# EAGLE design tiny_13 (EAGLE 4.16)
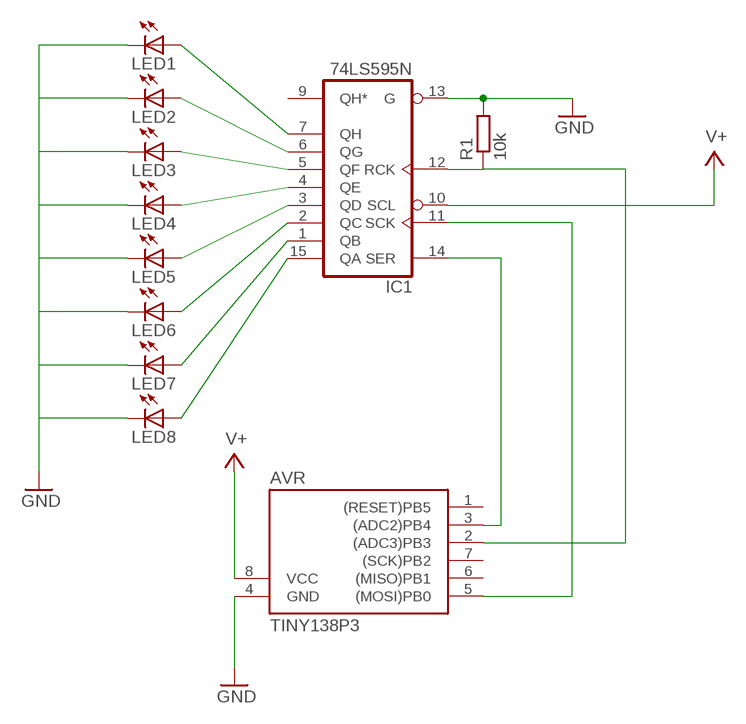
[diagram p0: schematic, sheet 1]

## Parts
AVR  TINY138P3  [DIL08]
IC1  74LS595N  [DIL16]
LED1  LED5MM  [LED5MM]
LED2  LED5MM  [LED5MM]
LED3  LED5MM  [LED5MM]
LED4  LED5MM  [LED5MM]
LED5  LED5MM  [LED5MM]
LED6  LED5MM  [LED5MM]
LED7  LED5MM  [LED5MM]
LED8  LED5MM  [LED5MM]
R1  10k  R-EU_0414/5V  [0414V]

## Nets
GND: AVR.4(GND) IC1.13(G) LED1.K(C) LED2.K(C) LED3.K(C) LED4.K(C) LED5.K(C) LED6.K(C) LED7.K(C) LED8.K(C) R1.2
N$1: AVR.2((ADC3)PB3) IC1.12(RCK) R1.1
N$2: IC1.7(QH) LED1.A
N$3: IC1.6(QG) LED2.A
N$4: IC1.5(QF) LED3.A
N$5: IC1.4(QE) LED4.A
N$6: IC1.3(QD) LED5.A
N$7: IC1.2(QC) LED6.A
N$8: IC1.1(QB) LED7.A
N$9: AVR.5((MOSI)PB0) IC1.11(SCK)
N$11: AVR.3((ADC2)PB4) IC1.14(SER)
N$12: IC1.15(QA) LED8.A
V+: AVR.8(VCC) IC1.10(SCL)
Unconnected: AVR.1((RESET)PB5) AVR.6((MISO)PB1) AVR.7((SCK)PB2) IC1.9(QH*)

## Power pins joined to a net without a drawn wire
GND: IC1.8(GND)
VCC: IC1.16(VCC)

## Library data of the parts
AVR = avr-3:TINY13*
IC1 = 74xx-us:74*595: 8-bit SHIFT REGISTER, output latch
LED1-LED8 = led:LED: LED OSRAM: - CHIPLED LG R971, LG N971, LY N971, LG Q971, LY Q971, LO R971, LY R971 LH N974, LH R974 LS Q976, LO Q976, LY Q976 LO Q996 - Hyper CHIPLED LW Q18S LB Q993, LB Q99A, LB R99A - SideLED LS A670, LO A670, LY A670, LG A670, LP A670 LB A673, LV A673, LT A673, LW A673 LH A674 LY A675 LS A676, LA A676, LO A676, LY A676, LW A676 LS A679, LY A679, LG A679 - Hyper Micro SIDELED® LS Y876, LA Y876, LO Y876, LY Y876 LT Y87S - SmartLED LW L88C, LW L88S LB L89C, LB L89S, LG L890 LS L89K, LO L89K, LY L89K LS L896, LA L896, LO L896, LY L896 - TOPLED LS T670, LO T670, LY T670, LG T670, LP T670 LSG T670, LSP T670, LSY T670, LOP T670, LYG T670 LG T671, LOG T671, LSG T671 LB T673, LV T673, LT T673, LW T673 LH T674 LS T676, LA T676, LO T676, LY T676, LB T676, LH T676, LSB T676, LW T676 LB T67C, LV T67C, LT T67C, LS T67K, LO T67K, LY T67K, LW E67C LS E67B, LA E67B, LO E67B, LY E67B, LB E67C, LV E67C, LT E67C LW T67C LS T679, LY T679, LG T679 LS T770, LO T770, LY T770, LG T770, LP T770 LB T773, LV T773, LT T773, LW T773 LH T774 LS E675, LA E675, LY E675, LS T675 LS T776, LA T776, LO T776, LY T776, LB T776 LHGB T686 LT T68C, LB T68C - Hyper Mini TOPLED® LB M676 - Mini TOPLED Santana® LG M470 LS M47K, LO M47K, LY M47K Source: http://www.osram.convergy.de - LUMILED® LXK2-PW12-R00, LXK2-PW12-S00, LXK2-PW14-U00, LXK2-PW14-V00 LXK2-PM12-R00, LXK2-PM12-S00, LXK2-PM14-U00 LXK2-PE12-Q00, LXK2-PE12-R00, LXK2-PE12-S00, LXK2-PE14-T00, LXK2-PE14-U00 LXK2-PB12-K00, LXK2-PB12-L00, LXK2-PB12-M00, LXK2-PB14-N00, LXK2-PB14-P00, LXK2-PB14-Q00 LXK2-PR12-L00, LXK2-PR12-M00, LXK2-PR14-Q00, LXK2-PR14-R00 LXK2-PD12-Q00, LXK2-PD12-R00, LXK2-PD12-S00 LXK2-PH12-R00, LXK2-PH12-S00 LXK2-PL12-P00, LXK2-PL12-Q00, LXK2-PL12-R00 Source: www.luxeon.com
R1 = rcl:R-EU_: RESISTOR, European symbol

## Board
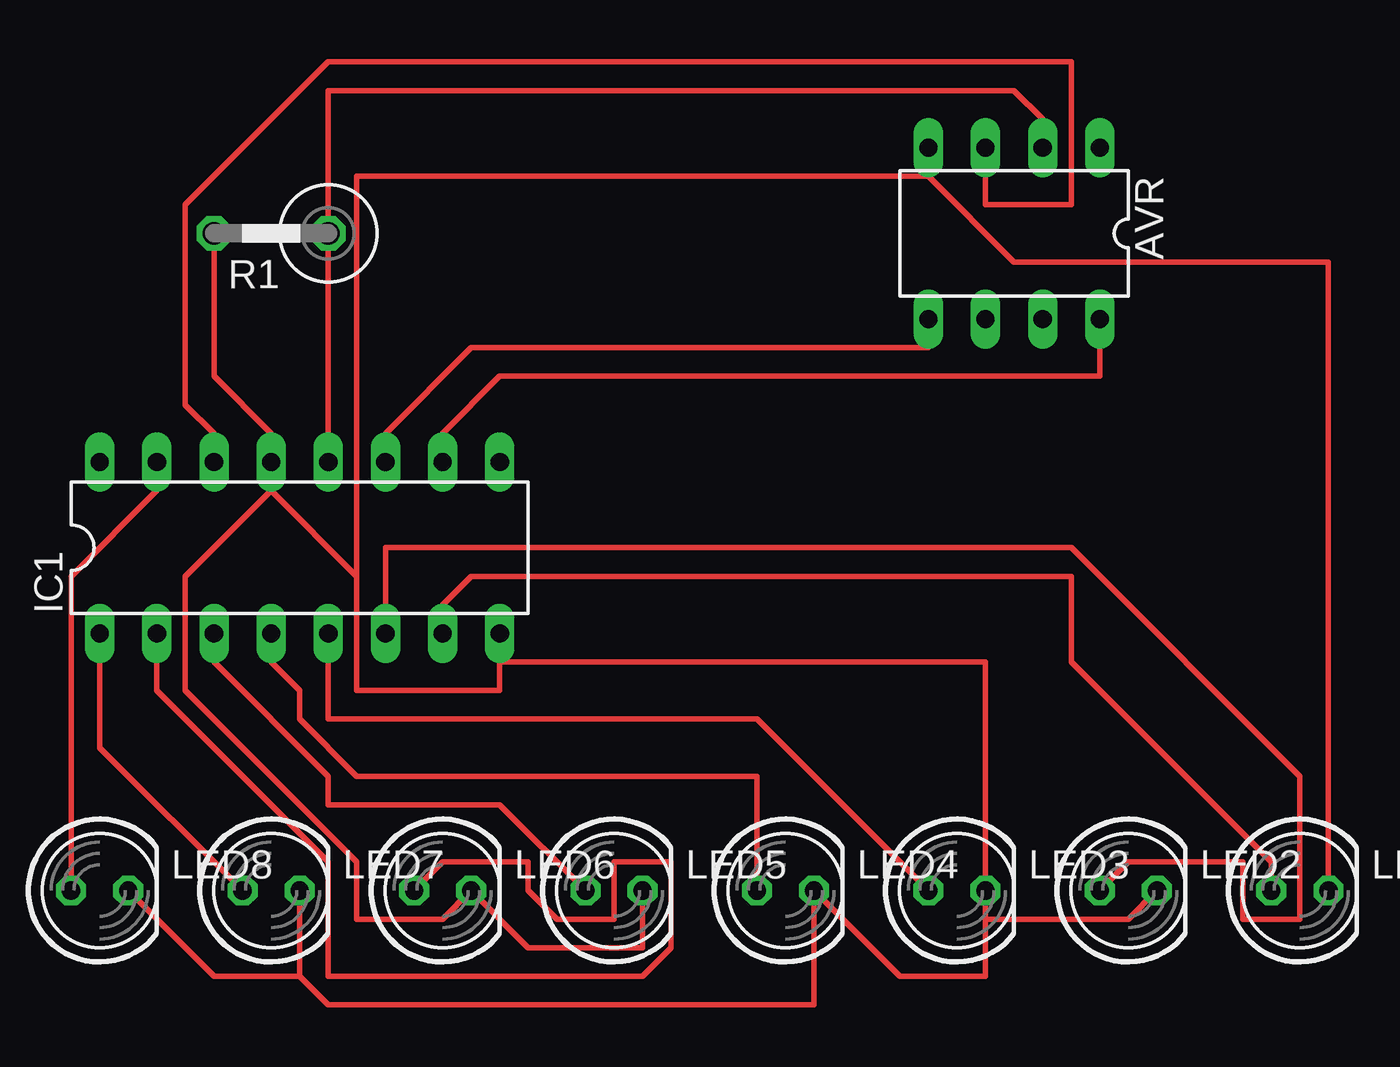
[diagram p1: board, top side]

No outline drawn. Coordinates in mm, seen from the top.
Copper layers (1*16): Top 0.035mm / dielectric 1.5mm / Bottom 0.035mm
Design rules "default": minimum track width 10mil, minimum drill 24mil, track to track 8mil, track to pad 8mil, pad to pad 8mil, via to via 8mil, smd to smd 8mil, copper to edge 40mil, drill to drill 8mil, minimum pad ring 10mil, minimum via ring 8mil, stop-mask expansion 4mil, vias tented up to drill 0mil, thermal gap 10mil

### Footprints (pad centres in the part's own frame; a part is rotated, then mirrored left to right if it is on the bottom)
DIL08 = drill 0.813 long: 1 -3.81,-3.81; 2 -1.27,-3.81; 3 1.27,-3.81; 4 3.81,-3.81; 5 3.81,3.81; 6 1.27,3.81; 7 -1.27,3.81; 8 -3.81,3.81
DIL16 = drill 0.813 long: 1 -8.89,-3.81; 2 -6.35,-3.81; 3 -3.81,-3.81; 4 -1.27,-3.81; 5 1.27,-3.81; 6 3.81,-3.81; 7 6.35,-3.81; 8 8.89,-3.81; 9 8.89,3.81; 10 6.35,3.81; 11 3.81,3.81; 12 1.27,3.81; 13 -1.27,3.81; 14 -3.81,3.81; 15 -6.35,3.81; 16 -8.89,3.81
LED5MM = drill 0.813 octagon: A -1.27,0; K 1.27,0
0414V = drill 1.016 octagon: 1 -2.54,0; 2 2.54,0

### Placement (x,y rotation side)
AVR  52.07,35.56 180 top
IC1  20.32,21.59 0 top
LED1  64.77,6.35 0 top
LED2  57.15,6.35 0 top
LED3  49.53,6.35 0 top
LED4  41.91,6.35 0 top
LED5  34.29,6.35 0 top
LED6  26.67,6.35 0 top
LED7  19.05,6.35 0 top
LED8  11.43,6.35 0 top
R1  19.05,35.56 180 top

### Tracks (layer width: path | path; a pad name or v marks a point on that pad's centre or on a via)
GND
  Top 0.254: 48.26,38.1 52.07,34.29 66.04,34.29 LED1.K | LED5.K 35.56,3.81 30.48,3.81 LED6.K 26.67,5.08 22.86,5.08 22.86,7.62 15.24,15.24 15.24,20.32 19.05,24.13 | R1.2 16.51,29.21 19.05,26.67 IC1.13 19.05,24.13 | LED8.K 16.51,2.54 20.32,2.54 | 20.32,2.54 LED7.K | 29.21,16.51 50.8,16.51 LED3.K 50.8,5.08 | 50.8,5.08 50.8,2.54 46.99,2.54 LED4.K 43.18,1.27 21.59,1.27 20.32,2.54 | LED2.K 57.15,5.08 50.8,5.08 | 22.86,20.32 19.05,24.13 | 22.86,20.32 22.86,15.24 29.21,15.24 29.21,16.51 | 29.21,16.51 IC1.8 | 48.26,38.1 22.86,38.1 22.86,20.32 | 48.26,38.1 AVR.4
N$1
  Top 0.254: IC1.12 R1.1 21.59,41.91 52.07,41.91 53.34,40.64 AVR.2
N$2
  Top 0.254: LED1.A 63.5,7.62 54.61,16.51 54.61,20.32 27.94,20.32 26.67,19.05 IC1.7
N$3
  Top 0.254: LED2.A 57.15,7.62 62.23,7.62 62.23,5.08 64.77,5.08 64.77,11.43 54.61,21.59 24.13,21.59 IC1.6
N$4
  Top 0.254: LED3.A 40.64,13.97 21.59,13.97 IC1.5
N$5
  Top 0.254: LED4.A 40.64,11.43 22.86,11.43 20.32,13.97 20.32,15.24 19.05,16.51 IC1.4
N$6
  Top 0.254: LED5.A 29.21,10.16 21.59,10.16 21.59,11.43 16.51,16.51 IC1.3
N$7
  Top 0.254: LED6.A 26.67,7.62 30.48,7.62 30.48,6.35 31.75,5.08 34.29,5.08 34.29,7.62 36.83,7.62 36.83,3.81 35.56,2.54 21.59,2.54 21.59,7.62 13.97,15.24 IC1.2
N$8
  Top 0.254: LED7.A 11.43,12.7 IC1.1
N$9
  Top 0.254: IC1.11 24.13,26.67 27.94,30.48 48.26,30.48 AVR.5
N$11
  Top 0.254: IC1.14 16.51,26.67 15.24,27.94 15.24,36.83 21.59,43.18 54.61,43.18 54.61,36.83 50.8,36.83 AVR.3
N$12
  Top 0.254: LED8.A 10.16,20.32 13.97,24.13 IC1.15
V+
  Top 0.254: IC1.10 26.67,26.67 29.21,29.21 55.88,29.21 AVR.8